# EAGLE design Simple_VGA (EAGLE 6.1)
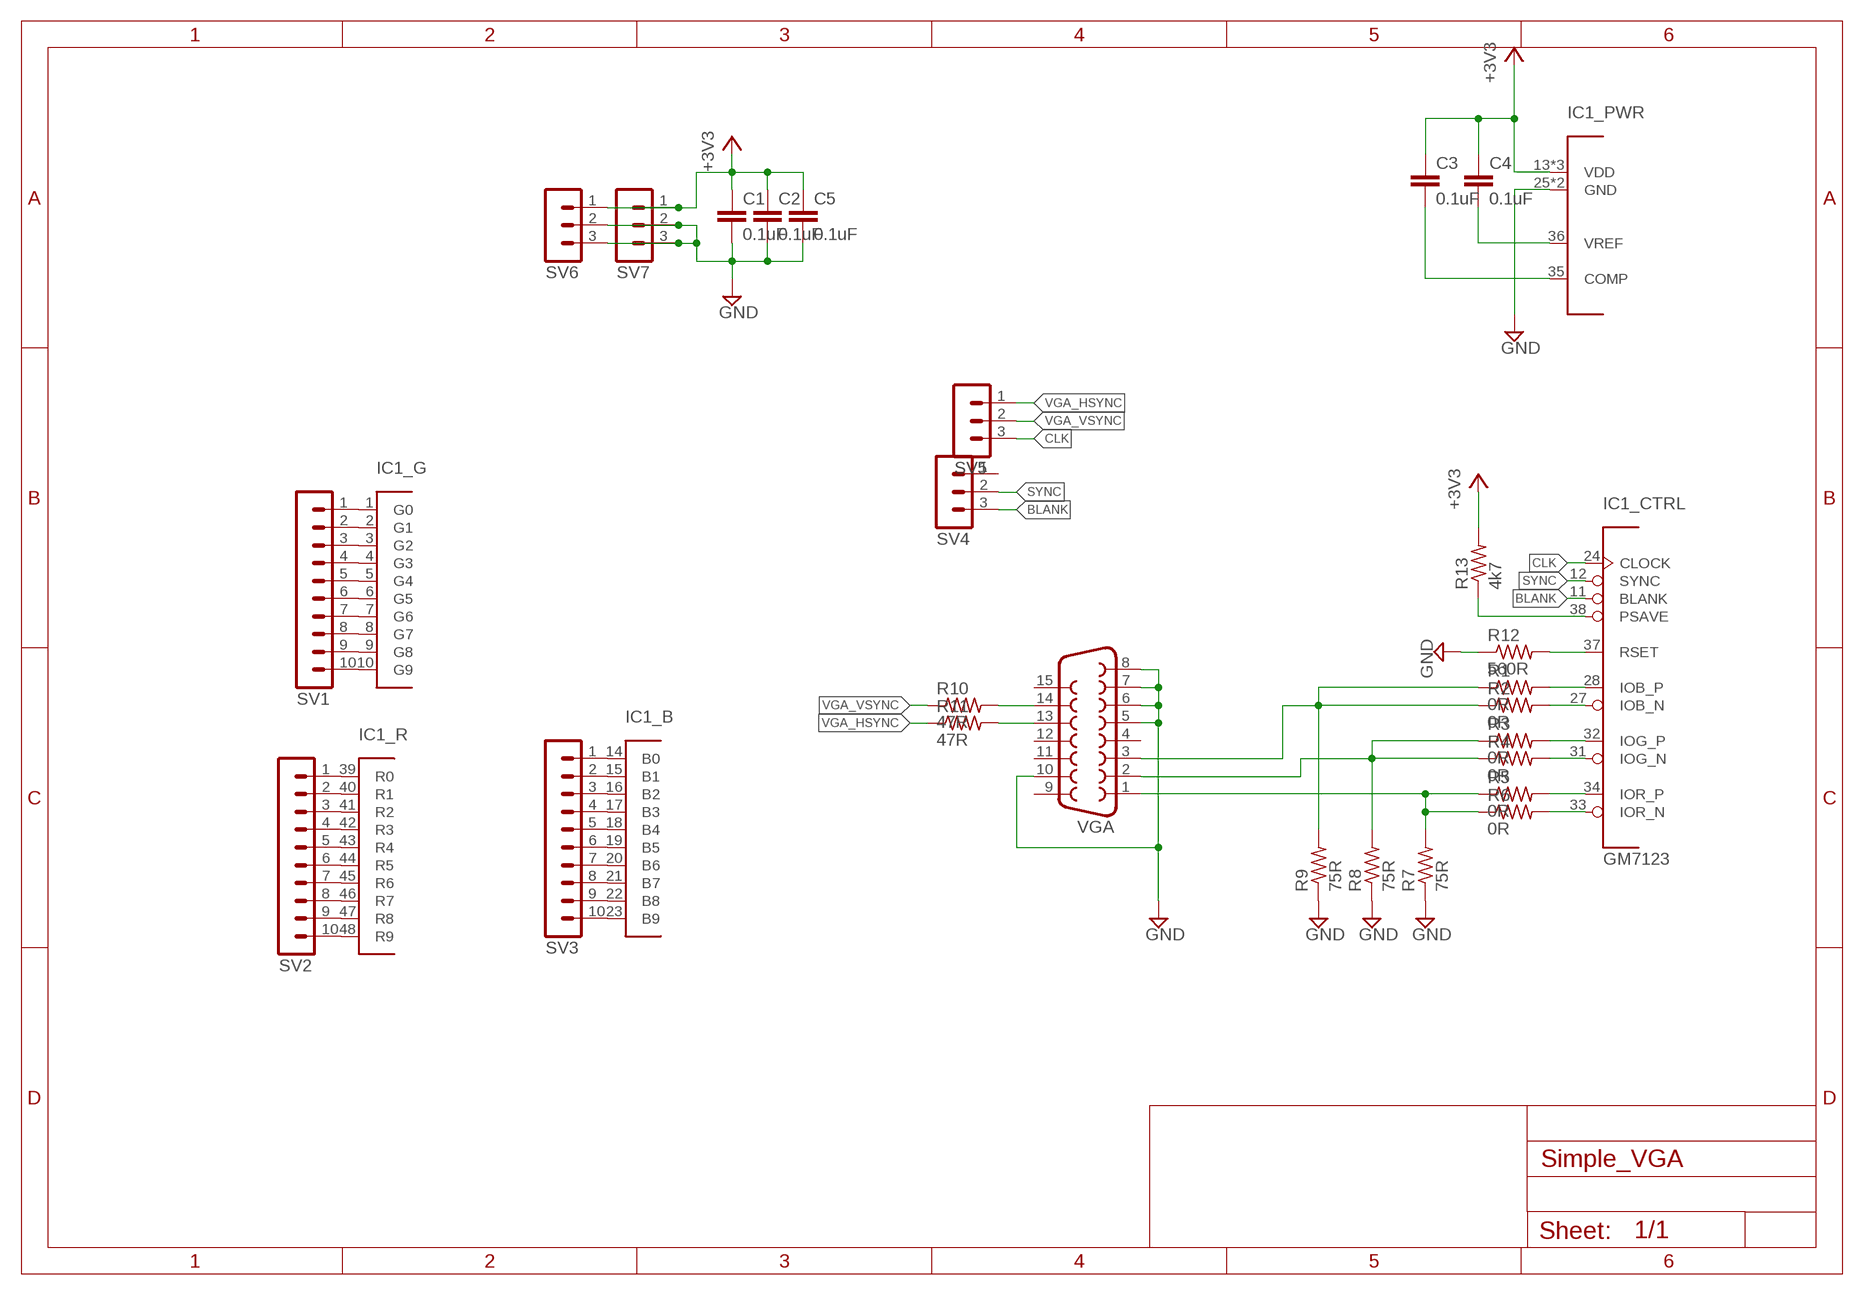
[diagram p0: schematic, sheet 1]

## Parts
C1  0.1uF  C-EUC1206  [C1206]
C2  0.1uF  C-EUC1206  [C1206]
C3  0.1uF  C-EUC1206  [C1206]
C4  0.1uF  C-EUC1206  [C1206]
C5  0.1uF  C-EUC1206  [C1206]
IC1  GM7123  [TQFP48]
R1  0R  R-US_R1206  [R1206]
R2  0R  R-US_R1206  [R1206]
R3  0R  R-US_R1206  [R1206]
R4  0R  R-US_R1206  [R1206]
R5  0R  R-US_R1206  [R1206]
R6  0R  R-US_R1206  [R1206]
R7  75R  R-US_R1206  [R1206]
R8  75R  R-US_R1206  [R1206]
R9  75R  R-US_R1206  [R1206]
R10  47R  R-US_R1206  [R1206]
R11  47R  R-US_R1206  [R1206]
R12  560R  R-US_R1206  [R1206]
R13  4k7  R-US_R1206  [R1206]
SV1  MA10-1  [MA10-1]
SV2  MA10-1  [MA10-1]
SV3  MA10-1  [MA10-1]
SV4  MA03-1  [MA03-1]
SV5  MA03-1  [MA03-1]
SV6  MA03-1  [MA03-1]
SV7  MA03-1  [MA03-1]
VGA  F15HDH  [HDF15H]

## Nets
+3V3: C1.1 C2.1 C3.1 C4.1 C5.1 IC1.13(_PWR:VDD) IC1.29(_PWR:VDD) IC1.30(_PWR:VDD) R13.2 SV6.1 SV7.1
BLANK: IC1.11(_CTRL:BLANK) SV4.3
CLK: IC1.24(_CTRL:CLOCK) SV5.3
GND: C1.2 C2.2 C5.2 IC1.25(_PWR:GND) IC1.26(_PWR:GND) R7.1 R8.1 R9.1 R12.1 SV6.2 SV6.3 SV7.2 SV7.3 VGA.5 VGA.6 VGA.7 VGA.8 VGA.10
N$1: IC1.1(_G:G0) SV1.1
N$2: IC1.2(_G:G1) SV1.2
N$3: IC1.3(_G:G2) SV1.3
N$4: IC1.4(_G:G3) SV1.4
N$5: IC1.5(_G:G4) SV1.5
N$6: IC1.6(_G:G5) SV1.6
N$7: IC1.7(_G:G6) SV1.7
N$8: IC1.8(_G:G7) SV1.8
N$9: IC1.9(_G:G8) SV1.9
N$10: IC1.10(_G:G9) SV1.10
N$11: IC1.39(_R:R0) SV2.1
N$12: IC1.40(_R:R1) SV2.2
N$13: IC1.41(_R:R2) SV2.3
N$14: IC1.42(_R:R3) SV2.4
N$15: IC1.43(_R:R4) SV2.5
N$16: IC1.44(_R:R5) SV2.6
N$17: IC1.45(_R:R6) SV2.7
N$18: IC1.46(_R:R7) SV2.8
N$19: IC1.47(_R:R8) SV2.9
N$20: IC1.48(_R:R9) SV2.10
N$21: IC1.14(_B:B0) SV3.1
N$22: IC1.15(_B:B1) SV3.2
N$23: IC1.16(_B:B2) SV3.3
N$24: IC1.17(_B:B3) SV3.4
N$25: IC1.18(_B:B4) SV3.5
N$26: IC1.19(_B:B5) SV3.6
N$27: IC1.20(_B:B6) SV3.7
N$28: IC1.21(_B:B7) SV3.8
N$29: IC1.22(_B:B8) SV3.9
N$30: IC1.23(_B:B9) SV3.10
N$31: IC1.28(_CTRL:IOB_P) R1.2
N$32: IC1.27(_CTRL:IOB_N) R2.2
N$33: IC1.32(_CTRL:IOG_P) R3.2
N$34: IC1.31(_CTRL:IOG_N) R4.2
N$35: IC1.34(_CTRL:IOR_P) R5.2
N$36: IC1.33(_CTRL:IOR_N) R6.2
N$37: R5.1 R6.1 R7.2 VGA.1
N$38: R3.1 R4.1 R8.2 VGA.2
N$39: R1.1 R2.1 R9.2 VGA.3
N$40: IC1.37(_CTRL:RSET) R12.2
N$41: IC1.38(_CTRL:PSAVE) R13.1
N$44: C4.2 IC1.36(_PWR:VREF)
N$45: C3.2 IC1.35(_PWR:COMP)
SYNC: IC1.12(_CTRL:SYNC) SV4.2
VGA_HSYNC: R11.1 SV5.1
VGA_HSYNC2: R11.2 VGA.13
VGA_VSYNC: R10.1 SV5.2
VGA_VSYNC2: R10.2 VGA.14
Unconnected: SV4.1 VGA.4 VGA.9 VGA.11 VGA.12 VGA.15

## Library data of the parts
C1-C5 = rcl:C-EU: CAPACITOR, European symbol
IC1 = 2ref-packages-longpad:GM7123
R1-R13 = resistor:R-US_: RESISTOR, American symbol
SV1-SV3 = con-lstb:MA10-1: PIN HEADER; OC_FARNELL: unknown; OC_NEWARK: unknown
SV4-SV7 = con-lstb:MA03-1: PIN HEADER; OC_FARNELL: unknown; OC_NEWARK: unknown
VGA = con-subd:F15: SUB-D; OC_FARNELL: unknown; OC_NEWARK: unknown

## Board
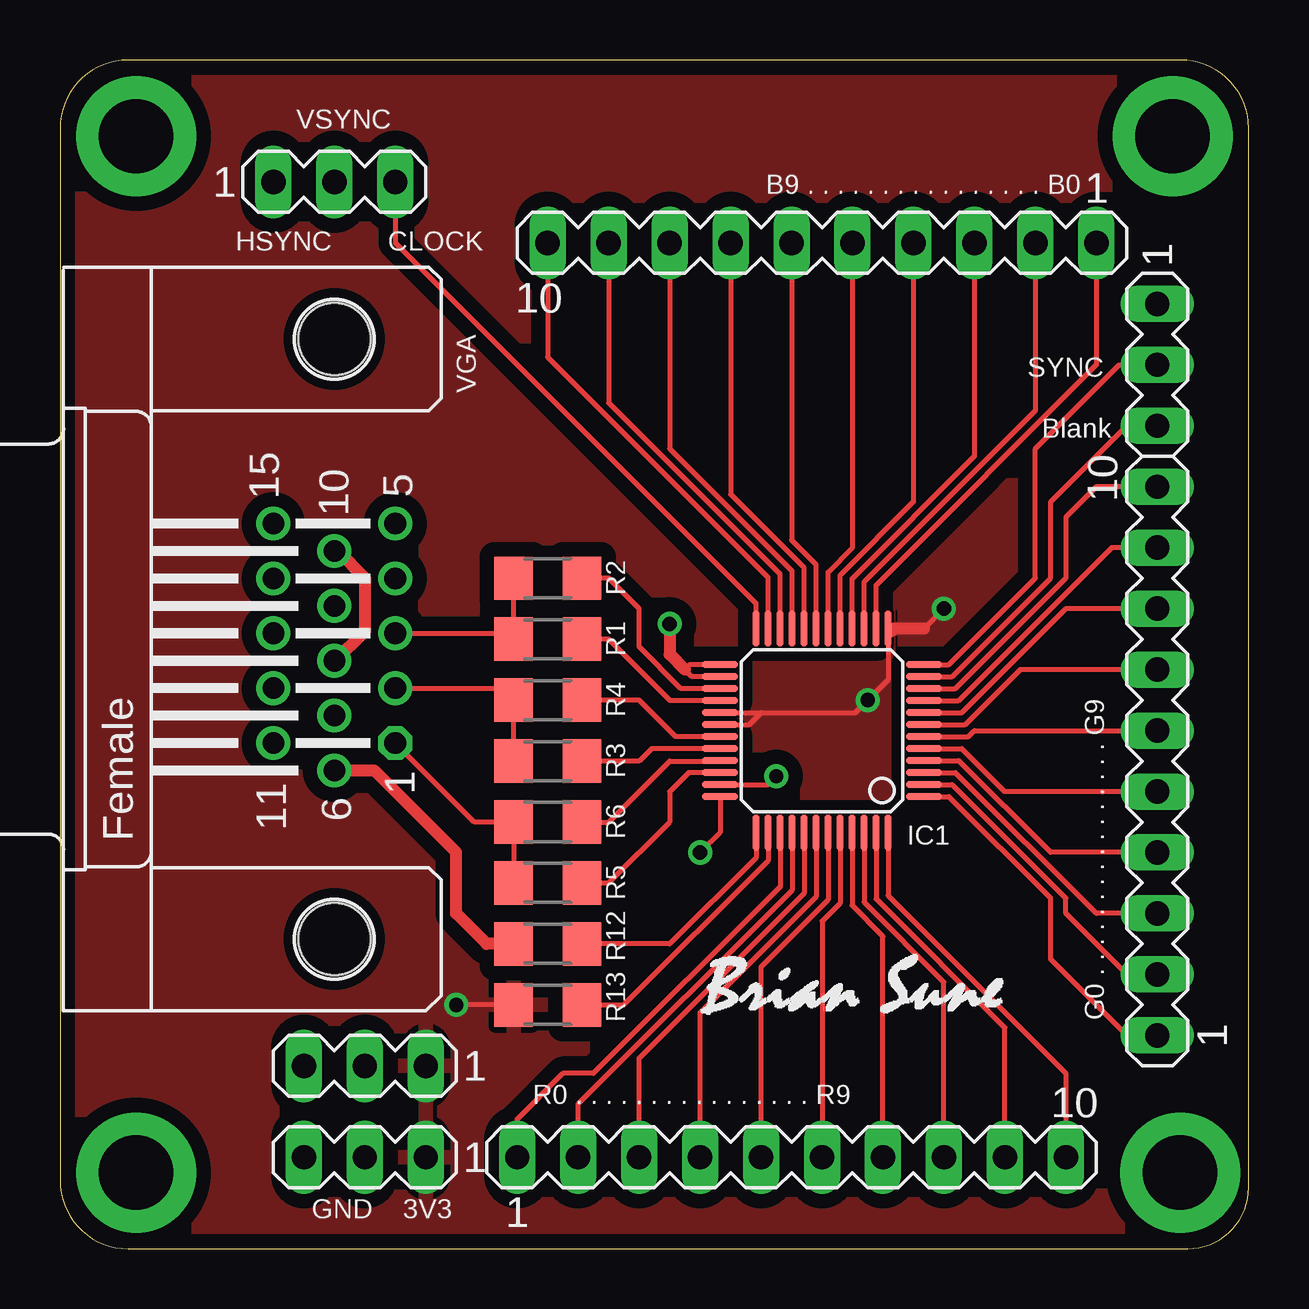
[diagram p1: board, top side]
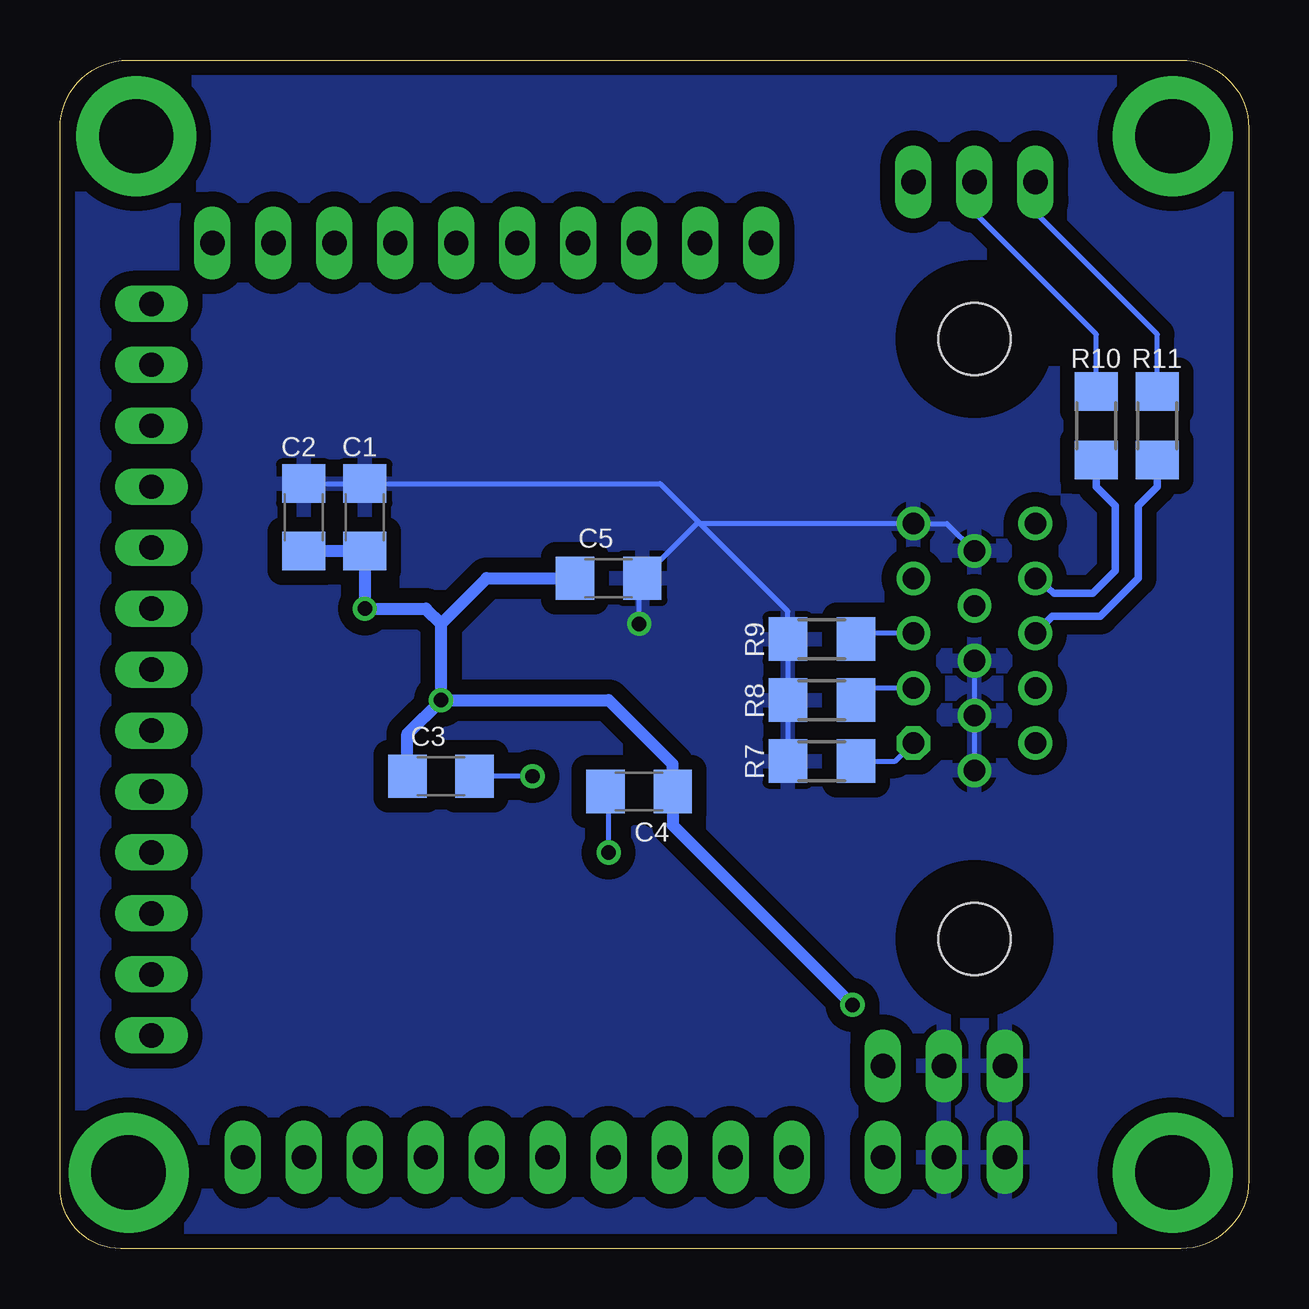
[diagram p2: board, bottom side, seen from below]

Size 49.53 x 49.53 mm. Coordinates in mm from the lower left corner, seen from the top.
Outline: 0,46.69 0,2.84 arc90 2.84,0 46.99,0 arc90 49.53,2.54 49.53,46.69 arc90 46.69,49.53 2.84,49.53 arc90 0,46.69
Copper layers (1*16): Top 0.035mm / dielectric 1.5mm / Bottom 0.035mm
Design rules: minimum track width 7mil, minimum drill 0.6mm, track to track 7mil, track to pad 7mil, pad to pad 7mil, via to via 7mil, smd to smd 7mil, copper to edge 10mil, drill to drill 10mil, minimum pad ring 10mil, minimum via ring 8mil, stop-mask expansion 1mil, vias tented up to drill 0.8mm, thermal gap 10mil

### Footprints (pad centres in the part's own frame; a part is rotated, then mirrored left to right if it is on the bottom)
C1206 = smd 1.6 x 1.8: 1 -1.4,0; 2 1.4,0
TQFP48 = smd 0.3 x 1.5: 1 -2.75,-4.25; 2 -2.25,-4.25; 3 -1.75,-4.25; 4 -1.25,-4.25; 5 -0.75,-4.25; 6 -0.25,-4.25; 7 0.25,-4.25; 8 0.75,-4.25; 9 1.25,-4.25; 10 1.75,-4.25; 11 2.25,-4.25; 12 2.75,-4.25; 25 2.75,4.25; 26 2.25,4.25; 27 1.75,4.25; 28 1.25,4.25; 29 0.75,4.25; 30 0.25,4.25; 31 -0.25,4.25; 32 -0.75,4.25; 33 -1.25,4.25; 34 -1.75,4.25; 35 -2.25,4.25; 36 -2.75,4.25 | smd 1.5 x 0.3: 13 4.25,-2.75; 14 4.25,-2.25; 15 4.25,-1.75; 16 4.25,-1.25; 17 4.25,-0.75; 18 4.25,-0.25; 19 4.25,0.25; 20 4.25,0.75; 21 4.25,1.25; 22 4.25,1.75; 23 4.25,2.25; 24 4.25,2.75; 37 -4.25,2.75; 38 -4.25,2.25; 39 -4.25,1.75; 40 -4.25,1.25; 41 -4.25,0.75; 42 -4.25,0.25; 43 -4.25,-0.25; 44 -4.25,-0.75; 45 -4.25,-1.25; 46 -4.25,-1.75; 47 -4.25,-2.25; 48 -4.25,-2.75
R1206 = smd 1.6 x 1.803: 1 -1.422,0; 2 1.422,0
MA10-1 = drill 1.016 long: 1 -11.43,0; 2 -8.89,0; 3 -6.35,0; 4 -3.81,0; 5 -1.27,0; 6 1.27,0; 7 3.81,0; 8 6.35,0; 9 8.89,0; 10 11.43,0
MA03-1 = drill 1.016 long: 1 -2.54,0; 2 0,0; 3 2.54,0
HDF15H = drill 0.9 octagon: 1 4.329,2.54 | drill 0.9: 2 2.043,2.54; 3 -0.243,2.54; 4 -2.529,2.54; 5 -4.815,2.54; 6 5.472,0; 7 3.186,0; 8 0.9,0; 9 -1.386,0; 10 -3.672,0; 11 4.329,-2.54; 12 2.043,-2.54; 13 -0.243,-2.54; 14 -2.529,-2.54; 15 -4.815,-2.54 | hole 3: -12.5,0; 12.5,0

### Placement (x,y rotation side)
C1  36.83,30.48 90 bottom
C2  39.37,30.48 90 bottom
C3  33.66,19.68 0 bottom
C4  25.4,19.05 180 bottom
C5  26.67,27.94 0 bottom
IC1  31.75,21.59 90 top
R1  20.32,25.4 0 top
R2  20.32,27.94 0 top
R3  20.32,20.32 0 top
R4  20.32,22.86 0 top
R5  20.32,15.24 0 top
R6  20.32,17.78 0 top
R7  17.78,20.32 0 bottom
R8  17.78,22.86 0 bottom
R9  17.78,25.4 0 bottom
R10  6.35,34.29 270 bottom
R11  3.81,34.29 270 bottom
R12  20.32,12.7 0 top
R13  20.32,10.16 180 top
SV1  45.72,20.32 90 top
SV2  30.48,3.81 0 top
SV3  31.75,41.91 180 top
SV4  45.72,36.83 270 top
SV5  11.43,44.45 0 top
SV6  12.7,3.81 180 top
SV7  12.7,7.62 180 top
VGA  11.43,25.4 270 top

### Tracks (layer width: path | path; a pad name or v marks a point on that pad's centre or on a via)
+3V3  (via drill 0.6)
  Top 0.203: 36,25.84 v36.83,26.67 | IC1.29 29.21,22.34 | 29.21,22.34 33.13,22.34 v33.66,22.86 34.5,23.7 IC1.13 34.5,25.82 34.61,25.72 | IC1.30 28.71,21.84 29.21,22.34 | R13.2 v16.51,10.16
  Top 0.508: 36,25.84 34.73,25.84 34.61,25.72
  Bottom 0.203: C5.1 28.57,27.94
  Bottom 0.508: v16.51,10.16 24,17.65 C4.1 24,20.19 26.67,22.86 v33.66,22.86 | C3.1 35.05,21.46 v33.66,22.86 | v33.66,22.86 33.66,26.04 | 33.66,26.04 31.75,27.94 28.57,27.94 | 33.66,26.04 34.29,26.67 v36.83,26.67 C1.1 C2.1
  pour Top (isolate 0.61): 0,49.53 49.53,49.53 49.53,0 0,0
BLANK
  Top 0.203: SV4.3 44.45,34.29 41.27,31.11 41.27,27.94 37.17,23.84 IC1.11
CLK
  Top 0.203: IC1.24 29,26.88 13.97,41.91 SV5.3
GND  (via drill 0.6)
  Top 0.203: IC1.26 26.32,23.84 26.04,24.13 26.25,24.34 IC1.25
  Top 0.508: R12.1 17.78,12.7 16.51,13.97 16.51,16.51 13.09,19.93 VGA.6 | VGA.10 11.57,29.07 12.7,27.94 12.7,25.72 11.43,24.45 | v25.4,26.04 25.4,24.77 26.04,24.13
  Bottom 0.203: v25.4,26.04 25.4,27.81 C5.2 23,30.21 22.86,30.21 | 22.86,30.21 VGA.5 12.57,30.21 VGA.10 | VGA.8 VGA.7 VGA.6 | 22.86,30.21 24.52,31.88 C1.2 C2.2 | 22.86,30.21 19.2,26.56 R9.1 R8.1 R7.1
  pour Bottom (isolate 0.61): 0,49.53 49.53,49.53 49.53,0 0,0
N$1
  Top 0.203: IC1.1 37.04,18.84 41.27,14.61 41.27,12.06 44.45,8.89 SV1.1
N$2
  Top 0.203: IC1.2 37.17,19.34 41.91,14.61 41.91,13.97 44.45,11.43 SV1.2
N$3
  Top 0.203: IC1.3 37.31,19.84 43.18,13.97 SV1.3
N$4
  Top 0.203: IC1.4 37.45,20.34 41.27,16.51 SV1.4
N$5
  Top 0.203: IC1.5 37.58,20.84 39.37,19.05 SV1.5
N$6
  Top 0.203: IC1.6 37.85,21.34 38.1,21.59 SV1.6
N$7
  Top 0.203: IC1.7 37.72,21.84 40.01,24.13 SV1.7
N$8
  Top 0.203: IC1.8 37.58,22.34 41.91,26.67 SV1.8
N$9
  Top 0.203: IC1.9 37.45,22.84 43.81,29.21 SV1.9
N$10
  Top 0.203: IC1.10 37.31,23.34 41.91,27.94 41.91,30.48 43.18,31.75 SV1.10
N$11
  Top 0.203: SV2.1 19.05,5.4 20.95,7.3 22.23,7.3 30,15.08 IC1.39
N$12
  Top 0.203: IC1.40 30.5,14.94 21.59,6.03 SV2.2
N$13
  Top 0.203: IC1.41 31,14.81 24.13,7.94 SV2.3
N$14
  Top 0.203: IC1.42 31.5,14.67 26.67,9.84 SV2.4
N$15
  Top 0.203: IC1.43 32,14.54 29.21,11.75 SV2.5
N$16
  Top 0.203: IC1.44 32.5,14.4 31.75,13.65 SV2.6
N$17
  Top 0.203: IC1.45 33,14.31 34.29,13.02 SV2.7
N$18
  Top 0.203: IC1.46 33.5,14.44 36.83,11.11 SV2.8
N$19
  Top 0.203: IC1.47 34,14.58 39.37,9.21 SV2.9
N$20
  Top 0.203: IC1.48 34.5,14.71 41.91,7.3 SV2.10
N$21
  Top 0.203: SV3.1 43.18,36.83 34,27.65 IC1.14
N$22
  Top 0.203: SV3.2 40.64,34.92 33.5,27.79 IC1.15
N$23
  Top 0.203: IC1.16 33,27.92 38.1,33.02 SV3.3
N$24
  Top 0.203: IC1.17 32.5,28.05 35.56,31.11 SV3.4
N$25
  Top 0.203: IC1.18 32,28.19 33.02,29.21 SV3.5
N$26
  Top 0.203: IC1.19 31.5,28.51 30.48,29.53 SV3.6
N$27
  Top 0.203: IC1.20 31,28.37 27.94,31.43 SV3.7
N$28
  Top 0.203: IC1.21 30.5,28.24 25.4,33.34 SV3.8
N$29
  Top 0.203: IC1.22 30,28.1 22.86,35.24 SV3.9
N$30
  Top 0.203: IC1.23 29.5,27.97 20.32,37.15 SV3.10
N$31
  Top 0.203: IC1.28 25.42,22.84 22.86,25.4 R1.2
N$32
  Top 0.203: IC1.27 25.87,23.34 24.13,25.08 24.13,26.67 22.86,27.94 R2.2
N$33
  Top 0.203: IC1.32 24.65,20.84 24.13,20.32 R3.2
N$34
  Top 0.203: IC1.31 25.65,21.34 24.13,22.86 R4.2
N$35
  Top 0.203: R5.2 22.86,15.24 25.4,17.78 25.4,19.05 26.19,19.84 IC1.34
N$36
  Top 0.203: R6.2 22.86,17.78 25.4,20.32 27.48,20.32 IC1.33
N$37
  Top 0.203: VGA.1 17.26,17.78 R6.1 R5.1
  Bottom 0.203: R7.2 14.72,20.32 VGA.1
N$38
  Top 0.203: VGA.2 18.4,23.36 R4.1 R3.1
  Bottom 0.203: VGA.2 15.86,23.36 R8.2
N$39
  Top 0.203: VGA.3 18.66,25.64 R1.1 R2.1
  Bottom 0.203: VGA.3 16.11,25.64 R9.2
N$40
  Top 0.203: IC1.37 29,16.3 25.4,12.7 R12.2
N$41
  Top 0.203: R13.1 23.5,10.16 29.5,16.16 IC1.38
N$44  (via drill 0.6)
  Top 0.203: IC1.36 27.5,17.34 v26.67,16.51
  Bottom 0.203: v26.67,16.51 26.67,18.92 C4.2
N$45  (via drill 0.6)
  Top 0.203: IC1.35 29.5,19.34 v29.84,19.68
  Bottom 0.203: v29.84,19.68 C3.2
N$46  (via drill 3.1 pad 5)
  other vias: 3.17,3.17
N$47  (via drill 3.1 pad 5)
  other vias: 46.67,3.17
N$48  (via drill 3.1 pad 5)
  other vias: 46.35,46.35
N$49  (via drill 3.1 pad 5)
  other vias: 3.17,46.35
SYNC
  Top 0.203: IC1.12 37.04,24.34 40.64,27.94 40.64,33.34 44.13,36.83 SV4.2
VGA_HSYNC
  Bottom 0.203: R11.1 3.81,38.1 8.89,43.18 SV5.1
VGA_HSYNC2
  Bottom 0.305: R11.2 3.81,31.75 4.6,30.96 4.6,27.94 6.19,26.35 8.18,26.35 VGA.13
VGA_VSYNC
  Bottom 0.203: R10.1 6.35,38.1 11.43,43.18 SV5.2
VGA_VSYNC2
  Bottom 0.305: R10.2 6.35,31.75 5.56,30.96 5.56,28.26 6.51,27.3 8.11,27.3 VGA.14

### Text on the board
tPlace: VSYNC | B9 . . . . . . . . . . . . . . . . B0 | HSYNC | CLOCK | SYNC | Blank | G0 . . . . . . . . . . . . . . . . G9 | R0 . . . . . . . . . . . . . . . . R9 | GND | 3V3